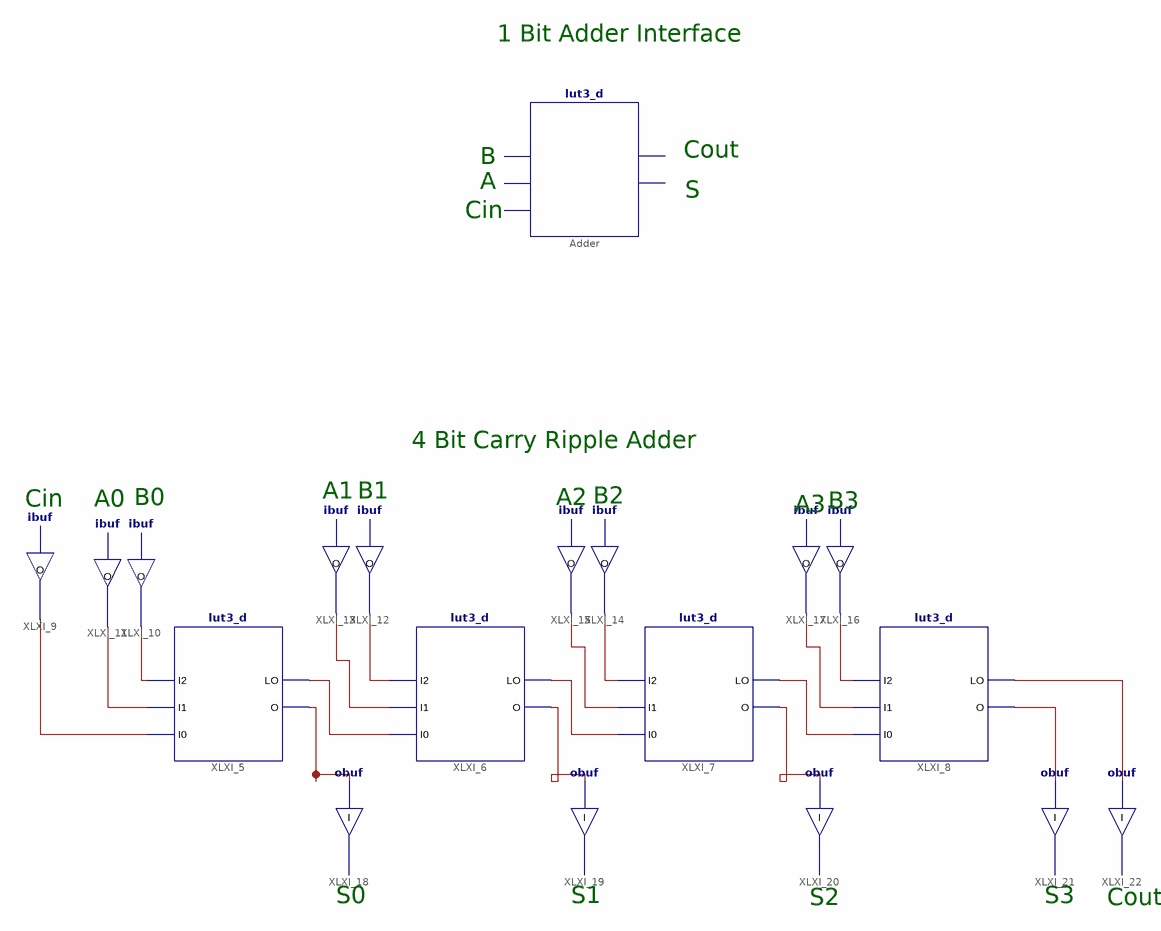
[diagram p0: schematic sheet 1]
// Xilinx ISE schematic Ful_Adder_4Bit.sch (spartan3e) as structural Verilog: 19 symbols, 0 ports
module Ful_Adder_4Bit (
);

  wire XLXN_1, XLXN_2, XLXN_3, XLXN_9, XLXN_10, XLXN_11, XLXN_12, XLXN_13, XLXN_14, XLXN_15, XLXN_16,
       XLXN_17, XLXN_18, XLXN_19, XLXN_20, XLXN_21, XLXN_22;

  lut3_d Adder ();  // open: I0, I1, I2, LO, O
  lut3_d XLXI_5 (.I0(XLXN_1), .I1(XLXN_2), .I2(XLXN_3), .LO(XLXN_10), .O(XLXN_9));
  lut3_d XLXI_6 (.I0(XLXN_10), .I1(XLXN_12), .I2(XLXN_11), .LO(XLXN_14), .O(XLXN_13));
  lut3_d XLXI_7 (.I0(XLXN_14), .I1(XLXN_16), .I2(XLXN_15), .LO(XLXN_18), .O(XLXN_17));
  lut3_d XLXI_8 (.I0(XLXN_18), .I1(XLXN_20), .I2(XLXN_19), .LO(XLXN_22), .O(XLXN_21));
  ibuf XLXI_12 (.O(XLXN_11));  // open: I
  ibuf XLXI_13 (.O(XLXN_12));  // open: I
  ibuf XLXI_14 (.O(XLXN_15));  // open: I
  ibuf XLXI_15 (.O(XLXN_16));  // open: I
  ibuf XLXI_16 (.O(XLXN_19));  // open: I
  ibuf XLXI_17 (.O(XLXN_20));  // open: I
  obuf XLXI_18 (.I(XLXN_9));  // open: O
  obuf XLXI_19 (.I(XLXN_13));  // open: O
  obuf XLXI_20 (.I(XLXN_17));  // open: O
  obuf XLXI_21 (.I(XLXN_21));  // open: O
  obuf XLXI_22 (.I(XLXN_22));  // open: O
  ibuf XLXI_9 (.O(XLXN_1));  // open: I
  ibuf XLXI_11 (.O(XLXN_2));  // open: I
  ibuf XLXI_10 (.O(XLXN_3));  // open: I

  // Notes on the sheet:
  //   1 Bit Adder Interface
  //   Cout
  //   B
  //   A
  //   S
  //   Cin
  //   4 Bit Carry Ripple Adder
  //   A1
  //   B1
  //   B2
  //   B0
  //   A2
  //   Cin
  //   A0
  //   B3
  //   A3
  //   S0
  //   S1
  //   S3
  //   S2
  //   Cout
endmodule
